# Altium schematic sheet driver_high_side.SchDoc
size A
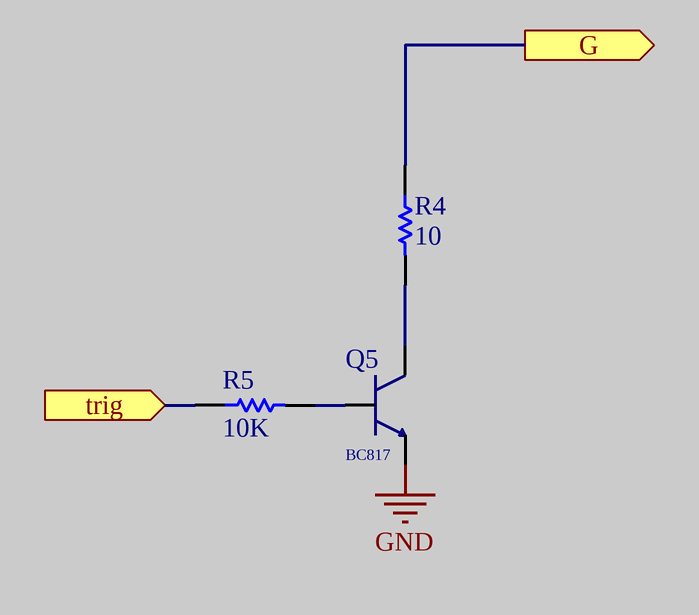
[diagram p0: driver_high_side.SchDoc]

## Parts
Q5  NPN transistor  [NPN]  (value not drawn)
R4  10  [RESC0603]
R5  10K  [RESC0603]

## Ports
G (out), trig (in)

## Nets
GND: Q5.2(E)
G: R4.1 ; port G
trig: R5.1 ; port trig
NetQ5_1: Q5.1(B) R5.2
NetQ5_3: Q5.3(C) R4.2

## Library data of the parts
Q5 = BC817: 45 V, 0.5 A; Transistor: BC817
R4 R5 = Resistor: 0603,0.1W; Published: 8-Jun-2000; LatestRevisionDate: 17-Jul-2002; LatestRevisionNote: Re-released for DXP Platform.; PackageReference: AXIAL-0.5; Publisher: Altium Limited
  R4: Value: 10
  R5: Value: 10K